# EasyEDA schematic Schematic-easyEda.json
TITLE: MitsuTester; REV: 1.0; Date: 2022-01-28; Sheet: 1/1; Drawn By: maretzky85
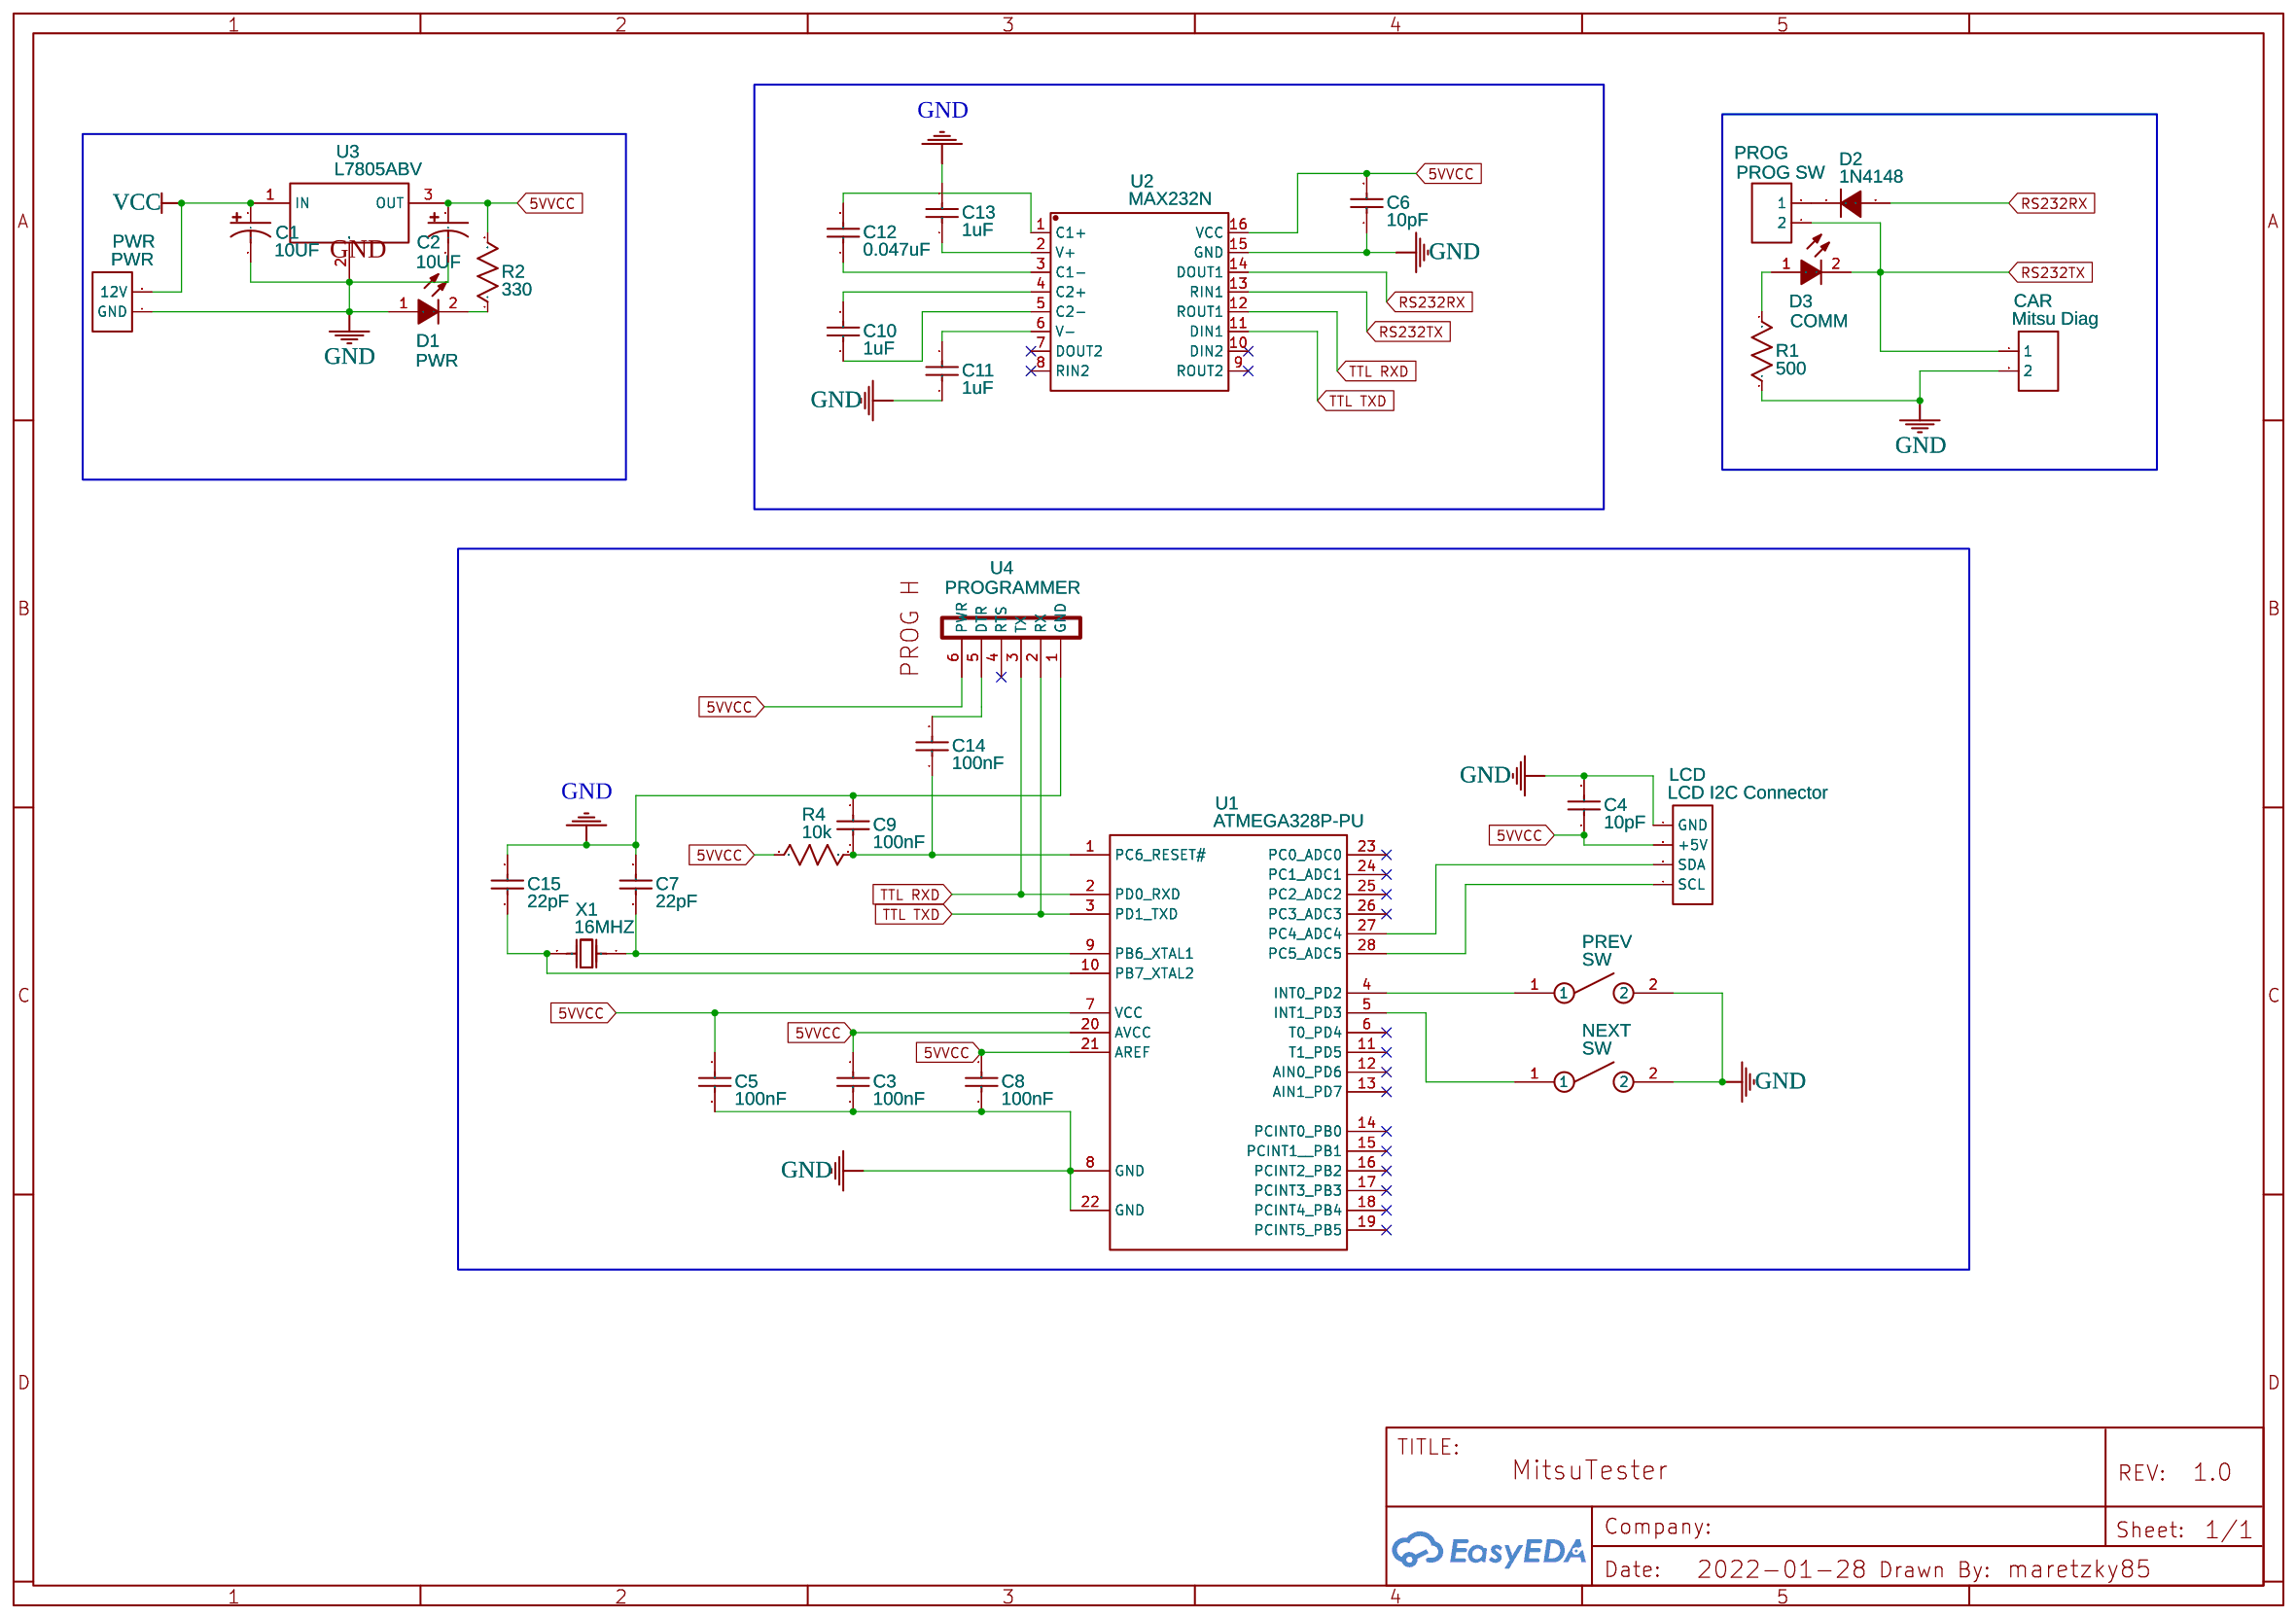
[diagram p0: schematic sheet]

## Parts
C1  10UF  [CPOL-RADIAL-10UF-25V-KIT]
C2  10UF  [CPOL-RADIAL-10UF-25V-KIT]
C3  100nF  [CERAMIC CAPACITOR]
C4  10pF  [CERAMIC CAPACITOR]
C5  100nF  [CERAMIC CAPACITOR]
C6  10pF  [CERAMIC CAPACITOR]
C7  22pF  [CERAMIC CAPACITOR]
C8  100nF  [CERAMIC CAPACITOR]
C9  100nF  [CERAMIC CAPACITOR]
C10  1uF  [CERAMIC CAPACITOR]
C11  1uF  [CERAMIC CAPACITOR]
C12  0.047uF  [CERAMIC CAPACITOR]
C13  1uF  [CERAMIC CAPACITOR]
C14  100nF  [CERAMIC CAPACITOR]
C15  22pF  [CERAMIC CAPACITOR]
CAR  Mitsu Diag  [HDR-F-2.54_1X2]
D1  PWR  [LED-TH_LED-DP2-2LED]
D2  1N4148  [THT-DIODE-2.54-4]
D3  COMM  [LED-TH_LED-DP2-2LED]
LCD  LCD I2C Connector  [HDR-F-2.54_1X4]
NEXT  SW  [SW2]
PREV  SW  [SW2]
PROG  PROG SW  [HDR-F-2.54_1X2]
PWR  PWR  [HDR-F-2.54_1X2]
R1  500  [R_AXIAL-0.3]
R2  330  [R_AXIAL-0.3]
R4  10k  [R_AXIAL-0.3]
U1  ATMEGA328P-PU  [DIP-28_L34.6-W7.3-P2.54-LS10.2-BL]
U2  MAX232N  [PDIP-16_L19.7-W6.6-P2.54-LS10.9-BL]
U3  L7805ABV  [TO-220-3_L10.0-W4.5-P2.54-L]
U4  PROGRAMMER  [HDR1X6]
X1  16MHZ  [HC-49S_L11.0-W4.6-P4.88]

## Library data of the parts
C1 C2 = 10UF-25V-20%(PTH)KIT: CAP-08440; Contributor: SparkFun
C3-C15 = 0.01 25V Ceramic capacitor: Supplier: LCSC; Manufacturer: ValuePro; Supplier Part: C22320; Contributor: GireeshTS
CAR PROG PWR = HDR-F-2.54_1x2: Supplier Part: C49661; Supplier: LCSC; Contributor: LCEDA_Lib
D1 D3 = 3mm Green TH LED 5600: Supplier: Digi-Key; Manufacturer: VccLite; Manufacturer Part: 5600; Supplier Part: L20325-ND; link: https://vcclite.com/product/5602f5-5v/; Contributor: pks.tec
D2 = 2.54_DUMMY_DIODE: Supplier: LCSC; Manufacturer: SEMTECH; Manufacturer Part: 1N4007; Supplier Part: C106903; LCSC Assembly: Yes; SMT Type: Extend
LCD = HDR-F-2.54_1x4: Supplier Part: C225501; Supplier: LCSC; Contributor: LCEDA_Lib
NEXT PREV = SW: Contributor: Fisher-1977
R1 R2 R4 = R_AXIAL-0.3_US: Contributor: LCEDA_Lib
U1 = ATMEGA328P-PU: sourceId: Oic6oiASL; Supplier: LCSC; Manufacturer: MICROCHIP; Contributor: LCSC; Supplier Part: C33901; JLCPCB Part Class: Extended Part
U2 = MAX232N: Supplier: LCSC; Supplier Part: C353147; Manufacturer: Texas Instruments; Contributor: LCSC; JLCPCB Part Class: Extended Part
U3 = L7805ABV: Supplier: LCSC; Manufacturer: STMicroelectronics; Supplier Part: C16807; JLCPCB Part Class: Extended Part
U4 = 6Pin Sip Header: Contributor: jmealy
X1 = CRYSTAL 16MHZ: Supplier: LCSC; Supplier Part: C390745; Manufacturer: JGHC; Manufacturer Part: 49SAC16000202060; Contributor: LCSC

## Nets
5VVCC: C2.1(+) C3.2 C4.1 C5.2 C6.2 C8.2 LCD.2(+5V) R2.2 R4.1 U1.7(VCC) U1.20(AVCC) U1.21(AREF) U2.16(VCC) U3.3(OUT) U4.6(PWR)
GND: C1.2(-) C2.2(-) C3.1 C4.2 C5.1 C6.1 C7.2 C8.1 C9.2 C11.1 C13.2 C15.2 CAR.2 D1.1(A) LCD.1(GND) NEXT.2 PREV.2 PWR.1(GND) R1.1 U1.8(GND) U1.22(GND) U2.15(GND) U3.2(GND) U4.1(GND)
VCC: C1.1(+) PWR.2(12V) U3.1(IN)
RS232RX: D2.2(A) U2.14(DOUT1)
RS232TX: CAR.1 D3.2(K) PROG.1(2) U2.13(RIN1)
TTL RXD: U1.2(PD0 RXD) U2.12(ROUT1) U4.3(TX)
TTL TXD: U1.3(PD1 TXD) U2.11(DIN1) U4.2(RX)
Net-(C7-1): C7.1 U1.9(PB6 XTAL1) X1.1(OSC1)
Net-(C9-1): C9.1 C14.1 R4.2 U1.1(PC6 RESET#)
Net-(C10-1): C10.1 U2.5(C2-)
Net-(C10-2): C10.2 U2.4(C2+)
Net-(C11-2): C11.2 U2.6(V-)
Net-(C12-1): C12.1 U2.3(C1-)
Net-(C12-2): C12.2 U2.1(C1+)
Net-(C13-1): C13.1 U2.2(V+)
Net-(C14-2): C14.2 U4.5(DTR)
Net-(C15-1): C15.1 U1.10(PB7 XTAL2) X1.2(OSC2)
Net-(D1-2): D1.2(K) R2.1
Net-(D2-1): D2.1(K) PROG.2(1)
Net-(D3-1): D3.1(A) R1.2
Net-(LCD-3): LCD.3(SDA) U1.27(PC4 ADC4)
Net-(LCD-4): LCD.4(SCL) U1.28(PC5 ADC5)
Net-(NEXT-1): NEXT.1 U1.5(INT1 PD3)
Net-(PREV-1): PREV.1 U1.4(INT0 PD2)

Not connected (* = marked no-connect by the designer): U1 6(T0 PD4)* 11(T1 PD5)* 12(AIN0 PD6)* 13(AIN1 PD7)* 14(PCINT0 PB0)* 15(PCINT1  PB1)* 16(PCINT2 PB2)* 17(PCINT3 PB3)* 18(PCINT4 PB4)* 19(PCINT5 PB5)* 23(PC0 ADC0)* 24(PC1 ADC1)* 25(PC2 ADC2)* 26(PC3 ADC3)*; U2 7(DOUT2)* 8(RIN2)* 9(ROUT2)* 10(DIN2)*; U4 4(RTS)*
